# EAGLE design TSOL_102A (EAGLE 8.5.0)
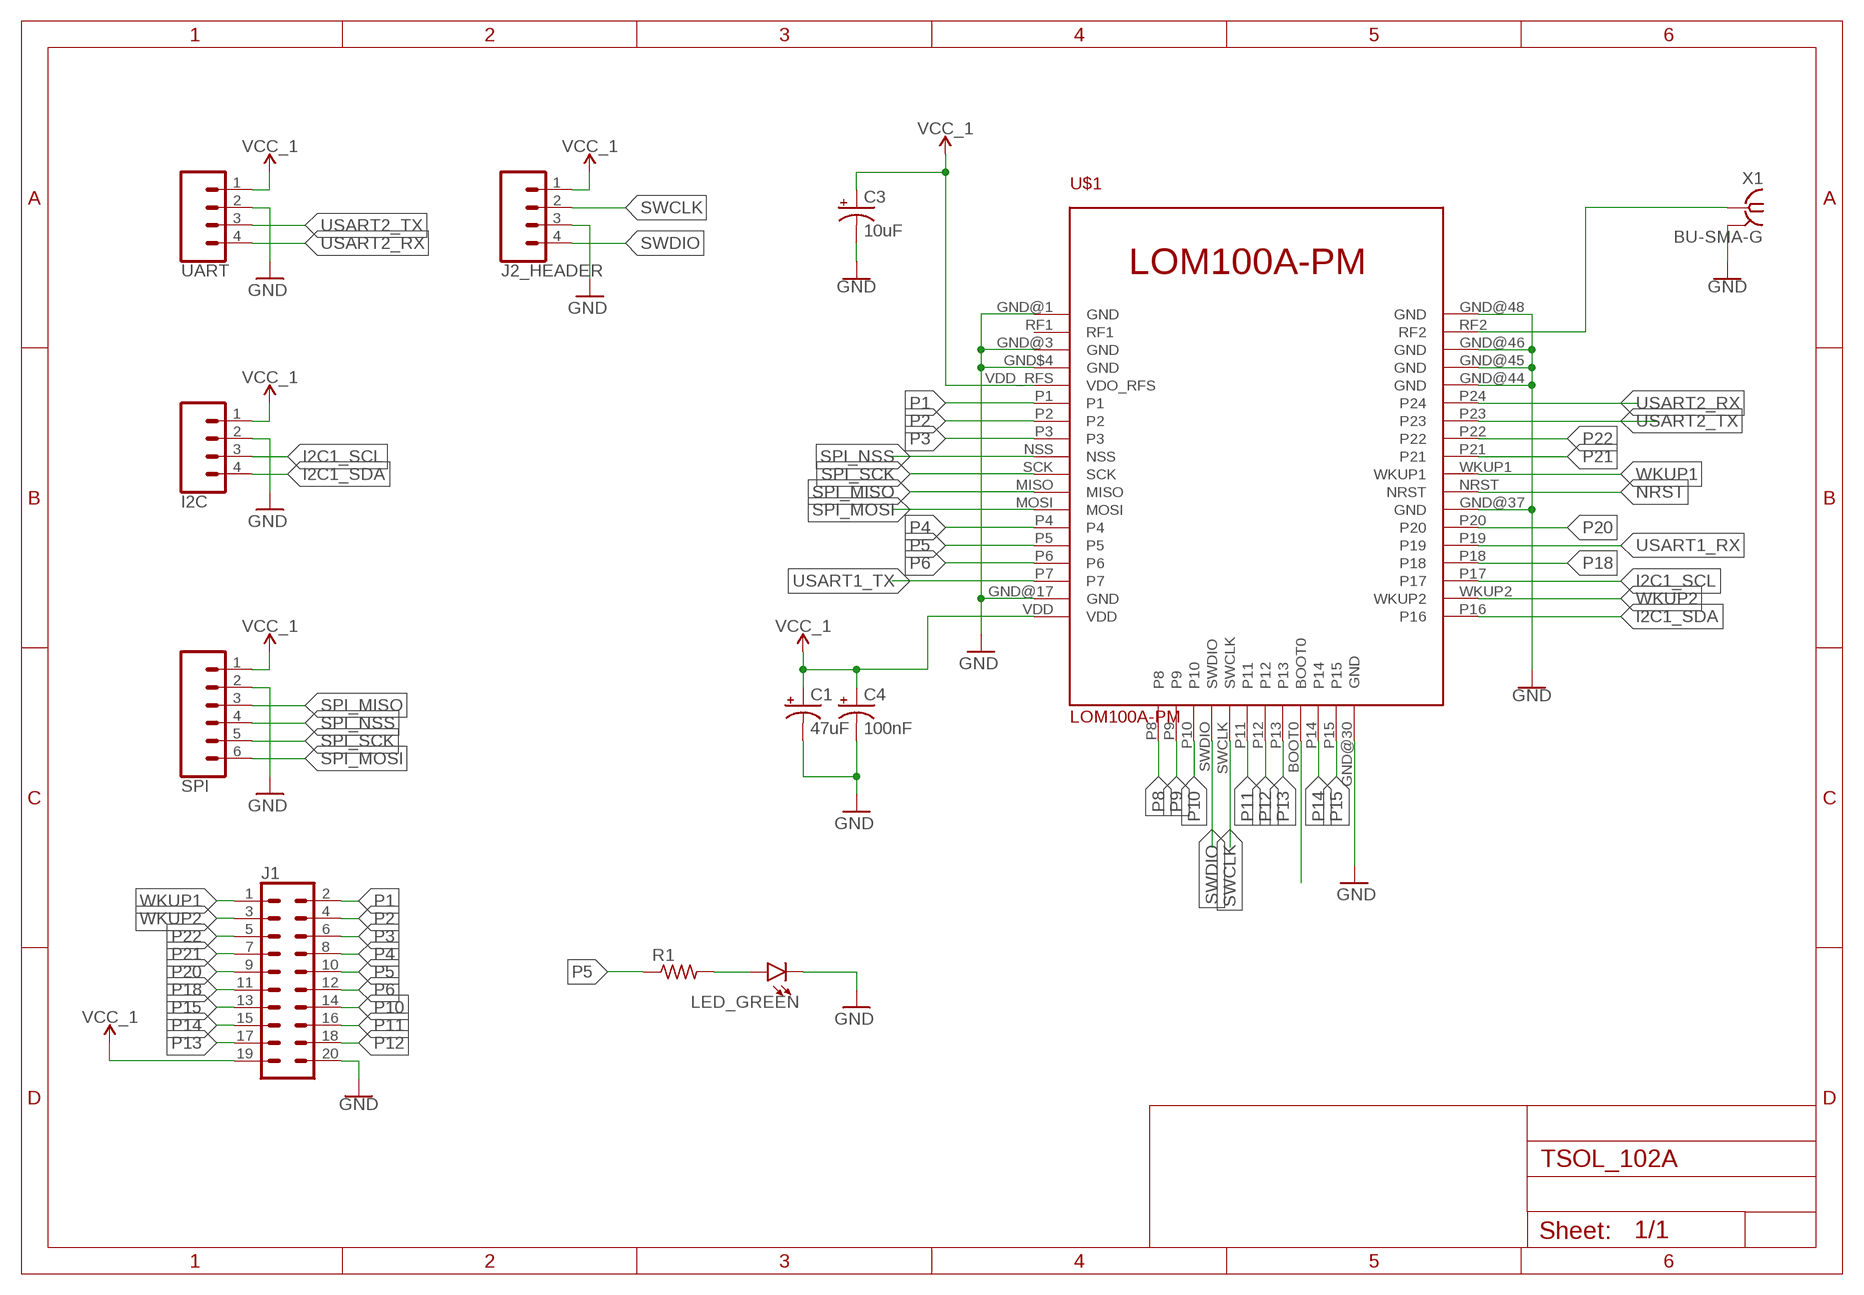
[diagram p0: schematic, sheet 1]

## Parts
C1  47uF  1000UF-RADIAL-5MM-35V-20%-KIT  [CPOL-RADIAL-5MM-10MM-KIT]
C3  10uF  1000UF-RADIAL-5MM-35V-20%-KIT  [CPOL-RADIAL-5MM-10MM-KIT]
C4  100nF  1000UF-RADIAL-5MM-35V-20%-KIT  [CPOL-RADIAL-5MM-10MM-KIT]
I2C  CONN_04LONGPADS  [1X04_LONGPADS]
J1  CONN_10X2  [2X10]
J2_HEADER  CONN_04LONGPADS  [1X04_LONGPADS]
LED_GREEN  LED5MM  [LED_5MM]
R1  R-US_0204/7  [0204/7]
SPI  CONN_06LONGPADS  [1X06_LONGPADS]
U$1  LOM100A-PM  [LOM100A-PM]
UART  CONN_04LONGPADS  [1X04_LONGPADS]
X1  BU-SMA-G  [BU-SMA-G]

## Nets
GND: C1.- C3.- C4.- I2C.2 J1.20 J2_HEADER.3 LED_GREEN.K(C) SPI.2 U$1.GND$4(GND) U$1.GND@1(GND) U$1.GND@3(GND) U$1.GND@17(GND) U$1.GND@30(GND) U$1.GND@37(GND) U$1.GND@44(GND) U$1.GND@45(GND) U$1.GND@46(GND) U$1.GND@48(GND) UART.2 X1.2 X1.3 X1.4 X1.5
I2C1_SCL: I2C.3 U$1.P17
I2C1_SDA: I2C.4 U$1.P16
N$2: U$1.RF2 X1.1
N$5: LED_GREEN.A R1.2
N$12: U$1.BOOT0
NRST: U$1.NRST
P1: J1.2 U$1.P1
P2: J1.4 U$1.P2
P3: J1.6 U$1.P3
P4: J1.8 U$1.P4
P5: J1.10 R1.1 U$1.P5
P6: J1.12 U$1.P6
P8: U$1.P8
P9: U$1.P9
P10: J1.14 U$1.P10
P11: J1.16 U$1.P11
P12: J1.18 U$1.P12
P13: J1.17 U$1.P13
P14: J1.15 U$1.P14
P15: J1.13 U$1.P15
P18: J1.11 U$1.P18
P20: J1.9 U$1.P20
P21: J1.7 U$1.P21
P22: J1.5 U$1.P22
SPI_MISO: SPI.3 U$1.MISO
SPI_MOSI: SPI.6 U$1.MOSI
SPI_NSS: SPI.4 U$1.NSS
SPI_SCK: SPI.5 U$1.SCK
SWCLK: J2_HEADER.2 U$1.SWCLK
SWDIO: J2_HEADER.4 U$1.SWDIO
USART1_RX: U$1.P19
USART1_TX: U$1.P7
USART2_RX: U$1.P24 UART.4
USART2_TX: U$1.P23 UART.3
VCC_1: C1.+ C3.+ C4.+ I2C.1 J1.19 J2_HEADER.1 SPI.1 U$1.VDD U$1.VDD_RFS(VDO_RFS) UART.1
WKUP1: J1.1 U$1.WKUP1
WKUP2: J1.3 U$1.WKUP2
Unconnected: U$1.RF1

## Library data of the parts
C1 C3 C4 = SparkFun-Capacitors:1000UF: 1,000µF/1mF ceramic capacitors A capacitor is a passive two-terminal electrical component used to store electrical energy temporarily in an electric field. CAP-08070; PROD_ID: CAP-09538; VALUE: 1mf
I2C J2_HEADER UART = SparkFun-Connectors:CONN_04: Multi connection point. Often used as Generic Header-pin footprint for 0.1 inch spaced/style header connections On any of the 0.1 inch spaced packages, you can populate with these: Break Away Headers - Straight <https://www.sparkfun.com/products/116> (PRT-00116) Break Away Male Headers - Right Angle <https://www.sparkfun.com/products/553> (PRT-00553) Female Headers <https://www.sparkfun.com/products/115> (PRT-00115) Break Away Headers - Machine Pin <https://www.sparkfun.com/products/117> (PRT-00117) Break Away Female Headers - Swiss Machine Pin <https://www.sparkfun.com/products/743> (PRT-00743) For SCREWTERMINALS and SPRING TERMINALS visit here: Screw Terimnals on SparkFun.com <https://www.sparkfun.com/search/results?term=Screw+Terminals> (5mm/3.5mm/2.54mm spacing) This device is also useful as a general connection point to wire up your design to another part of your project. Our various solder wires solder well into these plated through hole pads. Hook-Up Wire - Assortment (Stranded, 22 AWG) <https://www.sparkfun.com/products/11375> (PRT-11375) Hook-Up Wire - Assortment (Solid Core, 22 AWG) <https://www.sparkfun.com/products/11367> (PRT-11367) View the entire wire category on our website here <https://www.sparkfun.com/categories/141> Special notes: Molex polarized connector foot print use with SKU : PRT-08231 with associated crimp pins and housings. 1MM SMD Version SKU: PRT-10208; PROD_ID: CONN-09696
J1 = SparkFun-Connectors:CONN_10X2: Multi connection point. Often used as Generic Header-pin footprint for 0.1 inch spaced/style header connections On any of the 0.1 inch spaced packages, you can populate with these: Break Away Headers - Straight <https://www.sparkfun.com/products/116> (PRT-00116) Break Away Male Headers - Right Angle <https://www.sparkfun.com/products/553> (PRT-00553) Female Headers <https://www.sparkfun.com/products/115> (PRT-00115) Break Away Headers - Machine Pin <https://www.sparkfun.com/products/117> (PRT-00117) Break Away Female Headers - Swiss Machine Pin <https://www.sparkfun.com/products/743> (PRT-00743) Special note about the "SPECIAL" package: This was SPECIALLY designed to be used with our Graphic LCD Backpack. Be sure you want to use this! It is not only staggered on each line of header holes, but IT IS ALSO offset of the center point of the top and bottom lines by 5 mil. This causes the headers to lock into place on the "standard" footprint on the LCD screen. The extra squares on the tdocu layer are there simply to reference other pins (if you were to actually populate a longer header than ten long - this is what we do with the backpacks).
LED_GREEN = SparkFun-LED:LED: LED (Generic) Standard schematic elements and footprints for 5mm, 3mm, 1206, and 0603 sized LEDs. Generic LEDs with no color specified.
R1 = rcl:R-US_: RESISTOR, American symbol; SPICEPREFIX: R
SPI = SparkFun-Connectors:CONN_06: Multi connection point. Often used as Generic Header-pin footprint for 0.1 inch spaced/style header connections On any of the 0.1 inch spaced packages, you can populate with these: Break Away Headers - Straight <https://www.sparkfun.com/products/116> (PRT-00116) Break Away Male Headers - Right Angle <https://www.sparkfun.com/products/553> (PRT-00553) Female Headers <https://www.sparkfun.com/products/115> (PRT-00115) Break Away Headers - Machine Pin <https://www.sparkfun.com/products/117> (PRT-00117) Break Away Female Headers - Swiss Machine Pin <https://www.sparkfun.com/products/743> (PRT-00743) Arduino Stackable Header - 6 Pin <https://www.sparkfun.com/products/9280> (PRT-09280) For SCREWTERMINALS and SPRING TERMINALS visit here: Screw Terimnals on SparkFun.com <https://www.sparkfun.com/search/results?term=Screw+Terminals> (5mm/3.5mm/2.54mm spacing) This device is also useful as a general connection point to wire up your design to another part of your project. Our various solder wires solder well into these plated through hole pads. Hook-Up Wire - Assortment (Stranded, 22 AWG) <https://www.sparkfun.com/products/11375> (PRT-11375) Hook-Up Wire - Assortment (Solid Core, 22 AWG) <https://www.sparkfun.com/products/11367> (PRT-11367) View the entire wire category on our website here <https://www.sparkfun.com/categories/141>
U$1 = LOM100A-PM:LOM100A-PM
X1 = con-coax:BU-SMA-G: FEMALE SMA CONNECTOR Radiall distributor RS 193-9117; OC_FARNELL: unknown; OC_NEWARK: unknown

## Board
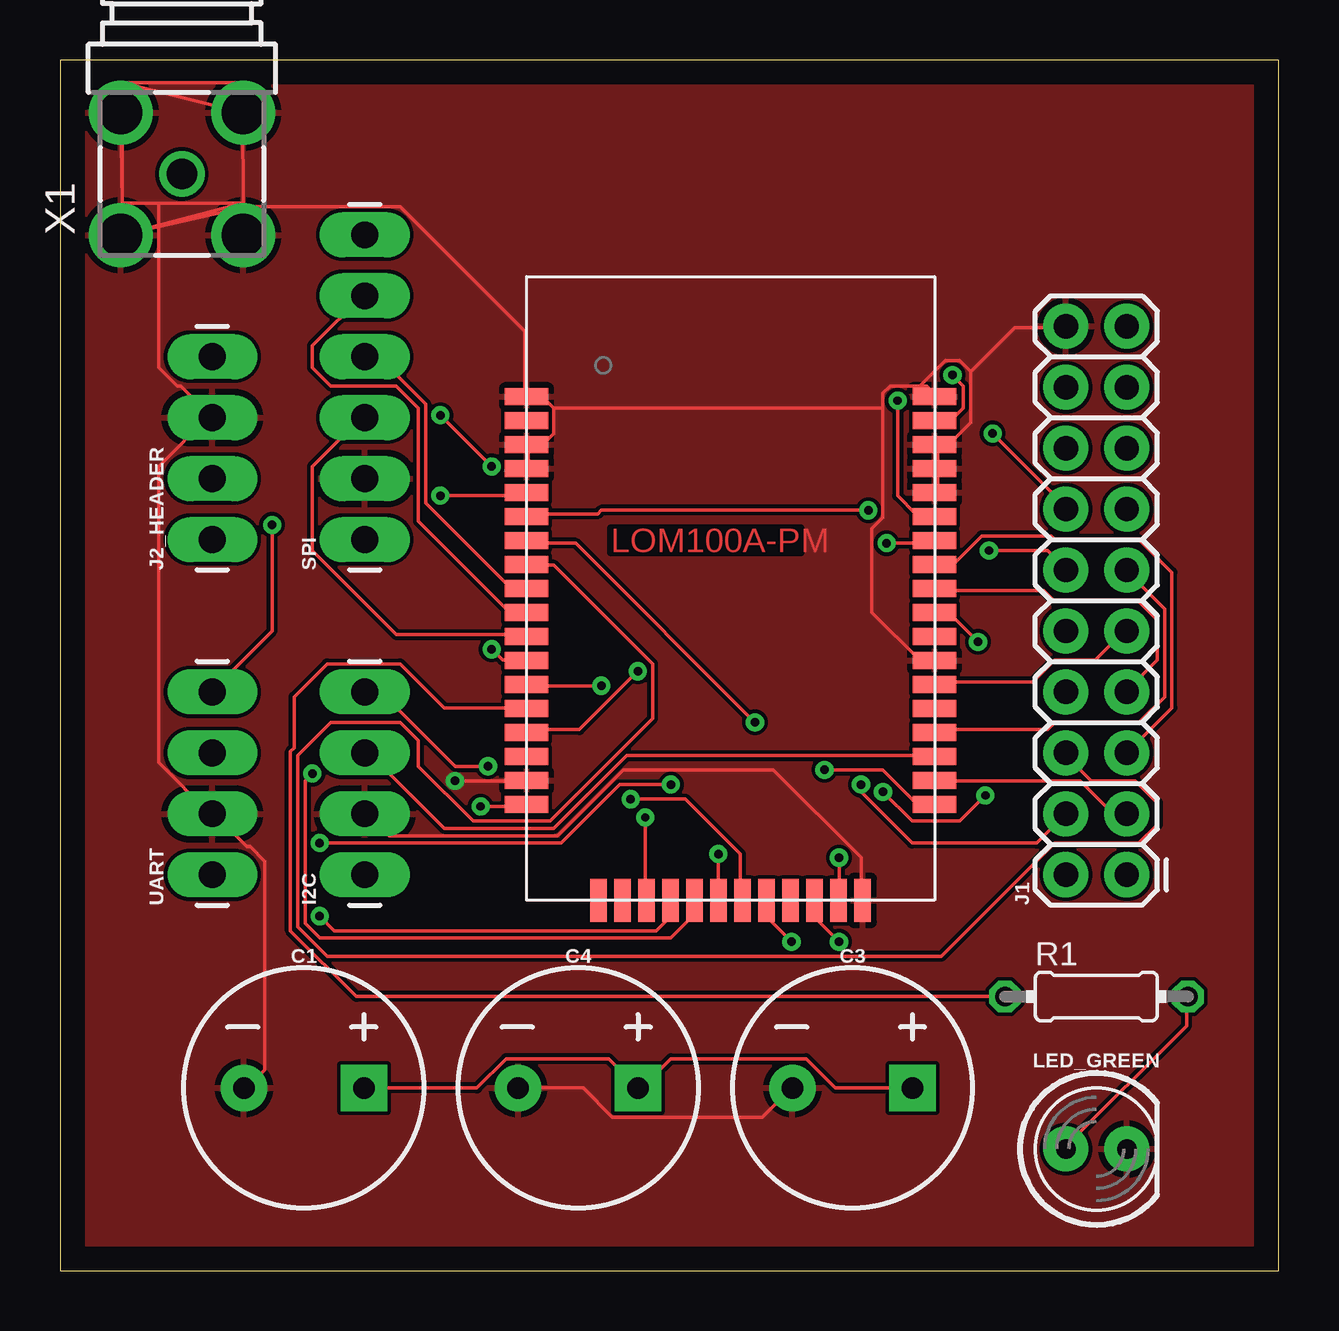
[diagram p1: board, top side]
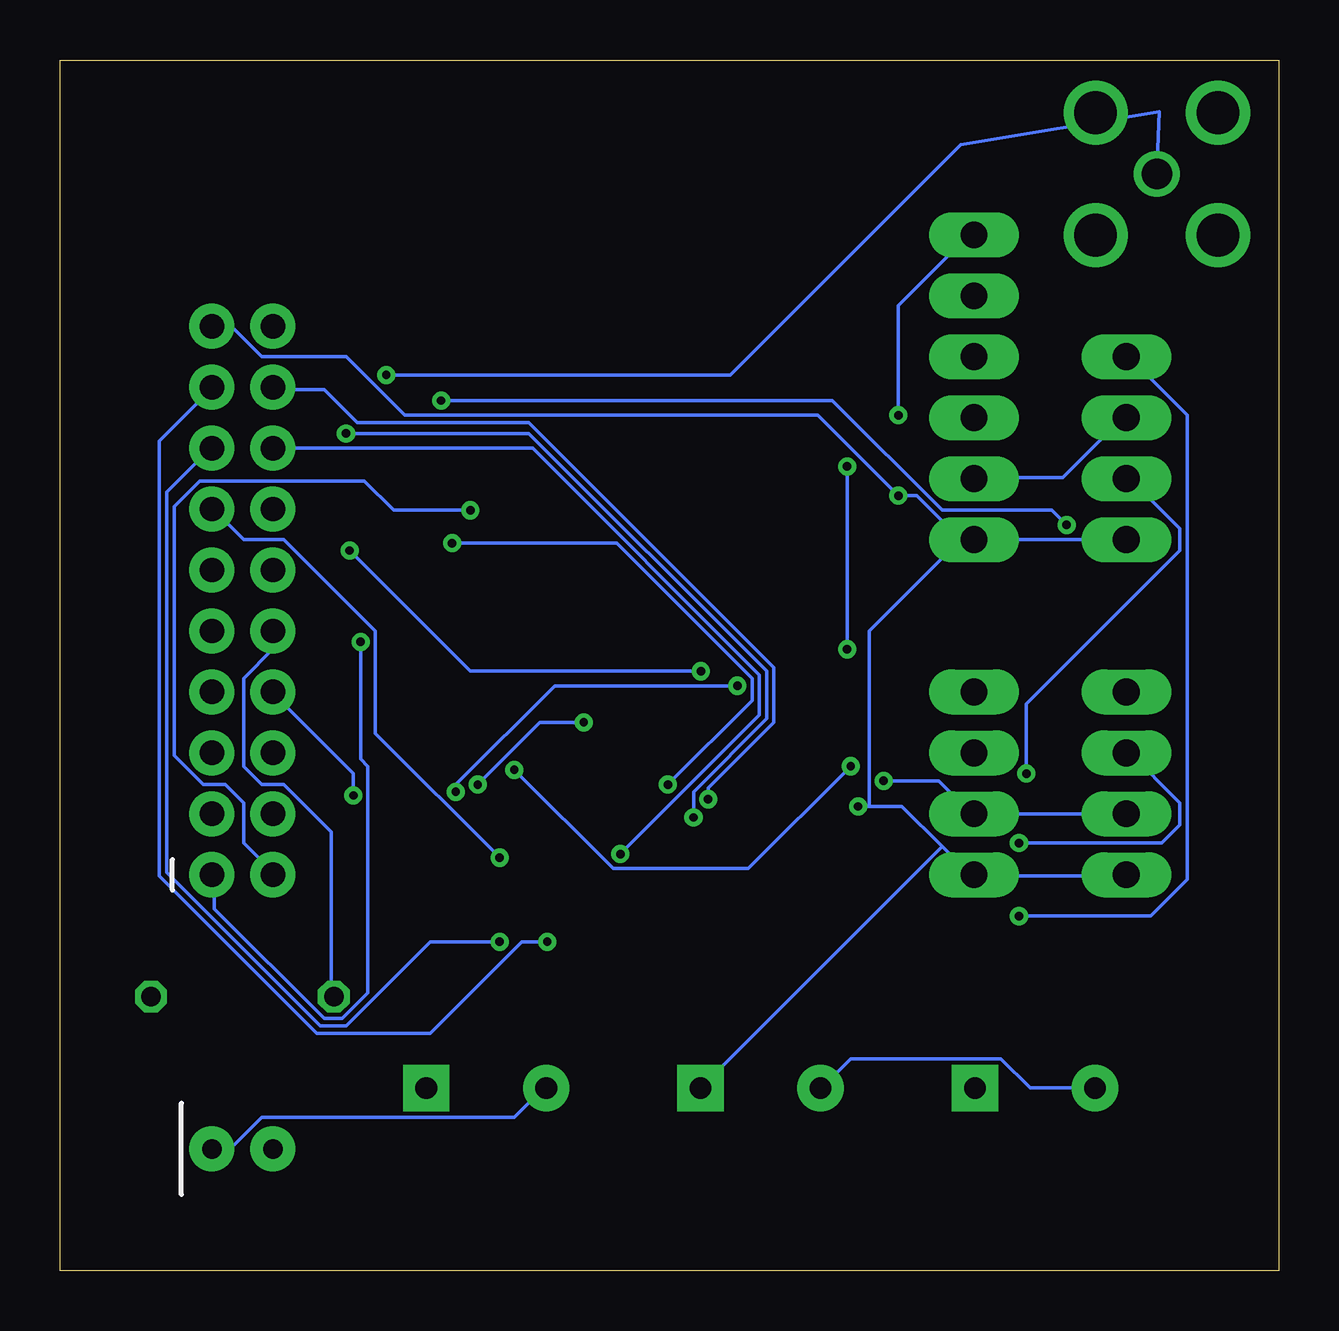
[diagram p2: board, bottom side, seen from below]

Size 50.78 x 50.47 mm. Coordinates in mm from the lower left corner, seen from the top.
Outline: 0,0 50.78,0 50.78,50.47 0,50.47 0,0
Copper layers (1*16): Top 0.035mm / dielectric 1.5mm / Bottom 0.035mm
Design rules "default": minimum track width 6mil, minimum drill 0.35mm, track to track 6mil, track to pad 6mil, pad to pad 6mil, via to via 6mil, smd to smd 6mil, copper to edge 40mil, drill to drill 6mil, minimum pad ring 10mil, minimum via ring 8mil, stop-mask expansion 4mil, vias tented up to drill 0mil, thermal gap 10mil

### Footprints (pad centres in the part's own frame; a part is rotated, then mirrored left to right if it is on the bottom)
CPOL-RADIAL-5MM-10MM-KIT = drill 0.9 pad 1.93 square: + 2.5,0 | drill 0.9 pad 1.93: - -2.5,0
1X04_LONGPADS = drill 1.118 pad 1.88 long: 1 0,0; 2 2.54,0; 3 5.08,0; 4 7.62,0
2X10 = drill 1.016 pad 1.88: 1 0,0; 2 0,2.54; 3 2.54,0; 4 2.54,2.54; 5 5.08,0; 6 5.08,2.54; 7 7.62,0; 8 7.62,2.54; 9 10.16,0; 10 10.16,2.54; 11 12.7,0; 12 12.7,2.54; 13 15.24,0; 14 15.24,2.54; 15 17.78,0; 16 17.78,2.54; 17 20.32,0; 18 20.32,2.54; 19 22.86,0; 20 22.86,2.54
LED_5MM = drill 0.813 pad 1.88: A -1.27,0; K 1.27,0
0204/7 = drill 0.813 octagon: 1 -3.81,0; 2 3.81,0
1X06_LONGPADS = drill 1.118 pad 1.88 long: 1 0,0; 2 2.54,0; 3 5.08,0; 4 7.62,0; 5 10.16,0; 6 12.7,0
LOM100A-PM = smd 0.7 x 1.8: BOOT0 2.5,-12.5; GND@30 5.5,-12.5; P8 -5.5,-12.5; P9 -4.5,-12.5; P10 -3.5,-12.5; P11 -0.5,-12.5; P12 0.5,-12.5; P13 1.5,-12.5; P14 3.5,-12.5; P15 4.5,-12.5; SWCLK -1.5,-12.5; SWDIO -2.5,-12.5 | smd 1.8 x 0.7: GND$4 -8.5,5.5; GND@1 -8.5,8.5; GND@3 -8.5,6.5; GND@17 -8.5,-7.5; GND@37 8.5,-2.5; GND@44 8.5,4.5; GND@45 8.5,5.5; GND@46 8.5,6.5; GND@48 8.5,8.5; MISO -8.5,-1.5; MOSI -8.5,-2.5; NRST 8.5,-1.5; NSS -8.5,0.5; P1 -8.5,3.5; P2 -8.5,2.5; P3 -8.5,1.5; P4 -8.5,-3.5; P5 -8.5,-4.5; P6 -8.5,-5.5; P7 -8.5,-6.5; P16 8.5,-8.5; P17 8.5,-6.5; P18 8.5,-5.5; P19 8.5,-4.5; P20 8.5,-3.5; P21 8.5,0.5; P22 8.5,1.5; P23 8.5,2.5; P24 8.5,3.5; RF1 -8.5,7.5; RF2 8.5,7.5; SCK -8.5,-0.5; VDD -8.5,-8.5; VDD_RFS -8.5,4.5; WKUP1 8.5,-0.5; WKUP2 8.5,-7.5
BU-SMA-G = drill 1.27: 1 0,0 | drill 1.778: 2 -2.55,2.55; 3 2.55,2.55; 4 2.55,-2.55; 5 -2.55,-2.55

### Placement (x,y rotation side)
C1  10.16,7.62 0 top
C3  33.02,7.62 0 top
C4  21.59,7.62 0 top
I2C  12.7,16.51 90 top
J1  44.45,16.51 90 top
J2_HEADER  6.35,30.48 90 top
LED_GREEN  43.18,5.08 0 top
R1  43.18,11.43 0 top
SPI  12.7,30.48 90 top
U$1  27.94,27.94 0 top
UART  6.35,16.51 90 top
X1  5.08,45.72 90 top

### Tracks (layer width: path | path; a pad name or v marks a point on that pad's centre or on a via)
GND  (via drill 0.35)
  Top 0.152: v16.46,20.42 19.36,20.42 U$1.GND@17 | U$1.GND@30 33.38,15.54 33.38,17.22 29.72,20.88 23.47,20.88 20.73,18.14 13.72,18.14 12.8,19.05 I2C.2 | C4.- 21.79,7.62 23.01,6.4 29.26,6.4 30.48,7.62 C3.- | C1.- 7.77,7.62 8.53,8.38 8.53,17.07 7.92,17.68 7.77,17.68 6.4,19.05 UART.2 6.25,19.05 4.12,21.18 4.12,33.53 6.25,35.66 | 2.59,49.53 2.59,44.5 | 2.59,44.5 4.12,44.5 | 4.12,44.5 7.62,44.5 X1.2 7.77,44.35 14.17,44.35 19.36,39.17 19.36,36.58 U$1.GND@1 19.51,36.42 20.12,36.42 20.57,35.97 | 2.59,44.5 X1.3 | 2.59,49.53 7.62,49.53 X1.5 | 2.59,49.53 X1.4 | 6.25,35.66 5.03,36.88 4.88,36.88 4.12,37.64 4.12,44.5 | U$1.GND$4 19.51,33.53 19.51,34.29 U$1.GND@3 19.51,34.44 20.12,34.44 20.57,34.9 20.57,35.97 | U$1.GND@44 36.58,32.46 36.58,33.38 U$1.GND@45 36.58,33.53 36.58,34.29 U$1.GND@46 36.58,34.44 37.03,34.44 37.95,35.36 37.95,37.49 | 34.29,35.97 34.29,36.58 34.59,36.88 35.81,36.88 | 34.29,35.97 34.29,31.39 33.83,30.94 33.83,27.43 35.81,25.45 36.42,25.45 U$1.GND@37 | 35.81,36.88 36.12,36.88 36.42,36.58 U$1.GND@48 | 37.95,37.49 37.49,37.95 36.88,37.95 35.81,36.88 | 34.29,35.97 20.57,35.97 | 37.95,37.49 39.78,39.32 41.91,39.32 J1.20 | 6.25,35.66 J2_HEADER.3
  Bottom 0.152: v16.46,20.42 14.17,20.42 12.8,19.05 I2C.2 UART.2 | C1.- 10.36,7.62 11.58,8.84 17.83,8.84 19.05,7.62 C4.- | LED_GREEN.K 44.35,5.18 43.59,5.18 42.37,6.4 31.85,6.4 30.63,7.62 C3.- | SPI.2 12.65,33.07 8.99,33.07 6.4,35.66 J2_HEADER.3
  pour Top: 0,0 50.8,0 50.8,50.8 0,50.8
I2C1_SCL
  Top 0.152: U$1.P17 36.42,21.49 23.62,21.49 20.57,18.44 16,18.44 12.8,21.64 I2C.3
I2C1_SDA  (via drill 0.35)
  Top 0.152: v31.85,20.88 34.29,20.88 35.66,19.51 36.42,19.51 U$1.P16 | v17.83,21.03 16.46,21.03 13.41,24.08 12.8,24.08 I2C.4
  Bottom 0.152: v31.85,20.88 27.74,16.76 22.1,16.76 v17.83,21.03
N$2  (via drill 0.35)
  Top 0.152: v37.19,37.34 37.64,36.88 37.64,35.97 37.19,35.51 36.58,35.51 U$1.RF2
  Bottom 0.152: v37.19,37.34 22.86,37.34 13.26,46.94 4.98,48.31 X1.1
N$5
  Top 0.152: R1.2 46.94,11.43 46.94,10.21 41.91,5.18 LED_GREEN.A
P1  (via drill 0.35)
  Top 0.152: v33.68,31.7 22.55,31.7 22.4,31.55 19.51,31.55 U$1.P1
  Bottom 0.152: v33.68,31.7 36.88,31.7 38.1,32.92 44.96,32.92 46.02,31.85 46.02,21.49 44.81,20.27 43.89,20.27 43.13,19.51 43.13,17.83 41.91,16.61 J1.2
P2  (via drill 0.35)
  Top 0.152: v28.96,22.86 21.49,30.33 19.51,30.33 U$1.P2 | v33.38,20.27 33.38,19.96 35.51,17.83 40.69,17.83 J1.4
  Bottom 0.152: v28.96,22.86 30.79,22.86 v33.38,20.27
P3
  Top 0.152: U$1.P3 19.51,29.41 20.57,29.41 24.69,25.3 24.69,23.01 20.42,18.75 17.22,18.75 14.94,21.03 14.94,22.1 14.17,22.86 11.28,22.86 9.91,21.49 9.91,14.33 11.12,13.11 36.73,13.11 41.45,17.83 44.96,17.83 45.72,18.59 45.72,19.51 44.81,20.42 42.98,20.42 41.91,21.49 J1.6
P4  (via drill 0.35)
  Top 0.152: v22.55,24.38 19.51,24.38 U$1.P4 | v34.29,19.96 35.51,18.75 37.49,18.75 v38.56,19.81
  Bottom 0.152: v22.55,24.38 30.18,24.38 34.29,20.27 v34.29,19.96 | v38.56,19.81 38.56,20.73 41.91,24.08 J1.8
P5
  Top 0.152: R1.1 12.34,11.43 9.6,14.17 9.6,21.64 9.75,21.79 9.75,23.93 11.12,25.3 14.17,25.3 16,23.47 19.36,23.47 U$1.P5
  Bottom 0.152: J1.10 41.91,25.91 43.13,24.69 43.13,21.03 42.37,20.27 41.45,20.27 39.47,18.29 39.47,11.43 R1.1
P6  (via drill 0.35)
  Top 0.152: v24.08,24.99 21.64,22.55 19.51,22.55 U$1.P6 | v38.71,30.02 41.15,30.02 41.91,29.26 J1.12
  Bottom 0.152: v24.08,24.99 33.68,24.99 v38.71,30.02
P10  (via drill 0.35)
  Top 0.152: v24.38,18.9 24.38,15.54 U$1.P10 | v38.86,34.9 41.91,31.85 J1.14
  Bottom 0.152: v24.38,18.9 24.38,19.96 21.34,23.01 21.34,24.99 31.24,34.9 v38.86,34.9
P11  (via drill 0.35)
  Top 0.152: v27.43,17.37 27.43,15.54 U$1.P11
  Bottom 0.152: v27.43,17.37 21.64,23.16 21.64,24.84 31.09,34.29 J1.16
P12  (via drill 0.35)
  Top 0.152: v23.77,19.66 26.06,19.66 28.35,17.37 28.35,15.54 U$1.P12
  Bottom 0.152: v23.77,19.66 23.77,20.12 21.03,22.86 21.03,25.15 31.24,35.36 38.41,35.36 39.78,36.73 41.91,36.73 J1.18
P13  (via drill 0.35)
  Top 0.152: v30.48,13.72 29.57,14.63 29.57,15.39 U$1.P13
  Bottom 0.152: v30.48,13.72 31.55,13.72 35.36,9.91 40.08,9.91 46.63,16.46 46.63,34.59 44.5,36.73 J1.17
P14  (via drill 0.35)
  Top 0.152: v32.46,13.72 31.55,14.63 31.55,15.39 U$1.P14
  Bottom 0.152: v32.46,13.72 35.36,13.72 38.86,10.21 39.93,10.21 46.33,16.61 46.33,32.46 44.5,34.29 J1.15
P15  (via drill 0.35)
  Top 0.152: v32.46,17.22 32.46,15.54 U$1.P15
  Bottom 0.152: v32.46,17.22 37.64,22.4 37.64,26.67 41.45,30.48 43.13,30.48 44.35,31.7 J1.13
P18
  Top 0.152: U$1.P18 36.58,22.55 41.15,22.55 41.45,22.86 44.96,22.86 46.02,23.93 46.02,27.58 44.5,29.11 J1.11
P20
  Top 0.152: U$1.P20 36.58,24.54 40.54,24.54 41.45,25.45 43.13,25.45 44.35,26.67 J1.9
P21
  Top 0.152: U$1.P21 36.58,28.35 41,28.35 41.45,27.89 44.96,27.89 45.72,27.13 45.72,25.45 44.5,24.23 J1.7
P22
  Top 0.152: J1.5 46.33,23.47 46.33,29.11 44.96,30.48 41.45,30.48 41.3,30.63 38.41,30.63 37.34,29.57 36.58,29.57 U$1.P22
SPI_MISO
  Top 0.152: U$1.MISO 19.36,26.52 14.02,26.52 10.52,30.02 10.52,33.53 12.65,35.66 SPI.3
SPI_MOSI  (via drill 0.35)
  Top 0.152: v17.98,25.91 18.44,25.45 19.36,25.45 U$1.MOSI | v15.85,35.66 v17.98,33.53
  Bottom 0.152: v17.98,33.53 v17.98,25.91 | v15.85,35.66 15.85,40.23 12.8,43.28 SPI.6
SPI_NSS
  Top 0.152: SPI.4 13.26,38.1 15.24,36.12 15.24,32 18.75,28.5 19.36,28.5 U$1.NSS
SPI_SCK
  Top 0.152: U$1.SCK 19.36,27.58 18.59,27.58 14.94,31.24 14.94,35.97 14.02,36.88 11.28,36.88 10.52,37.64 10.52,38.56 12.65,40.69 SPI.5
SWCLK  (via drill 0.35)
  Top 0.152: v10.52,20.73 10.21,20.42 10.21,14.48 10.82,13.87 25.45,13.87 26.36,14.78 26.36,15.39 U$1.SWCLK
  Bottom 0.152: v10.52,20.73 10.52,23.62 4.12,30.02 4.12,30.94 6.25,33.07 J2_HEADER.2
SWDIO  (via drill 0.35)
  Top 0.152: v10.82,14.78 11.43,14.17 24.84,14.17 25.3,14.63 25.3,15.39 U$1.SWDIO
  Bottom 0.152: v10.82,14.78 5.33,14.78 3.81,16.31 3.81,35.66 6.25,38.1 J2_HEADER.4
USART2_RX  (via drill 0.35)
  Top 0.152: v34.9,36.27 34.9,32.31 35.66,31.55 36.42,31.55 U$1.P24 | v8.84,31.09 8.84,26.67 6.4,24.23 UART.4
  Bottom 0.152: v34.9,36.27 18.59,36.27 14.02,31.7 9.45,31.7 v8.84,31.09
USART2_TX  (via drill 0.35)
  Top 0.152: v34.44,30.33 36.42,30.33 U$1.P23 | v25.45,20.27 23.32,20.27 20.88,17.83 v10.82,17.83
  Bottom 0.152: v34.44,30.33 27.58,30.33 21.95,24.69 21.95,23.77 v25.45,20.27 | v10.82,17.83 4.88,17.83 4.12,18.59 4.12,19.51 6.25,21.64 UART.3
VCC_1  (via drill 0.35)
  Top 0.152: C1.+ 17.37,7.62 18.59,8.84 22.86,8.84 C4.+ 24.23,7.62 25.45,8.84 31.09,8.84 32.31,7.62 C3.+ | v17.53,19.36 19.36,19.36 U$1.VDD | v15.85,32.31 19.36,32.31 U$1.VDD_RFS
  Bottom 0.152: 17.07,19.36 15.7,19.36 14.02,17.68 | 17.07,19.36 v17.53,19.36 | 14.02,17.68 12.8,16.46 I2C.1 12.65,16.46 6.4,16.46 UART.1 | 13.26,30.48 15.09,32.31 v15.85,32.31 19.2,35.66 36.42,35.66 38.86,38.1 42.37,38.1 43.59,39.32 44.35,39.32 J1.19 | SPI.1 13.26,30.48 | SPI.1 J2_HEADER.1 | 17.07,19.36 17.07,26.67 13.26,30.48 | 12.8,30.48 SPI.1 | 14.02,17.68 C4.+
WKUP1  (via drill 0.35)
  Top 0.152: v38.25,26.21 37.03,27.43 36.58,27.43 U$1.WKUP1
  Bottom 0.152: v38.25,26.21 38.25,21.34 37.95,21.03 37.95,11.58 39.01,10.52 39.78,10.52 44.35,15.09 44.35,16.46 J1.1
WKUP2
  Top 0.152: J1.3 43.89,19.05 42.52,20.42 36.58,20.42 U$1.WKUP2